# EAGLE design mosfet_breakout (EAGLE 5.10)
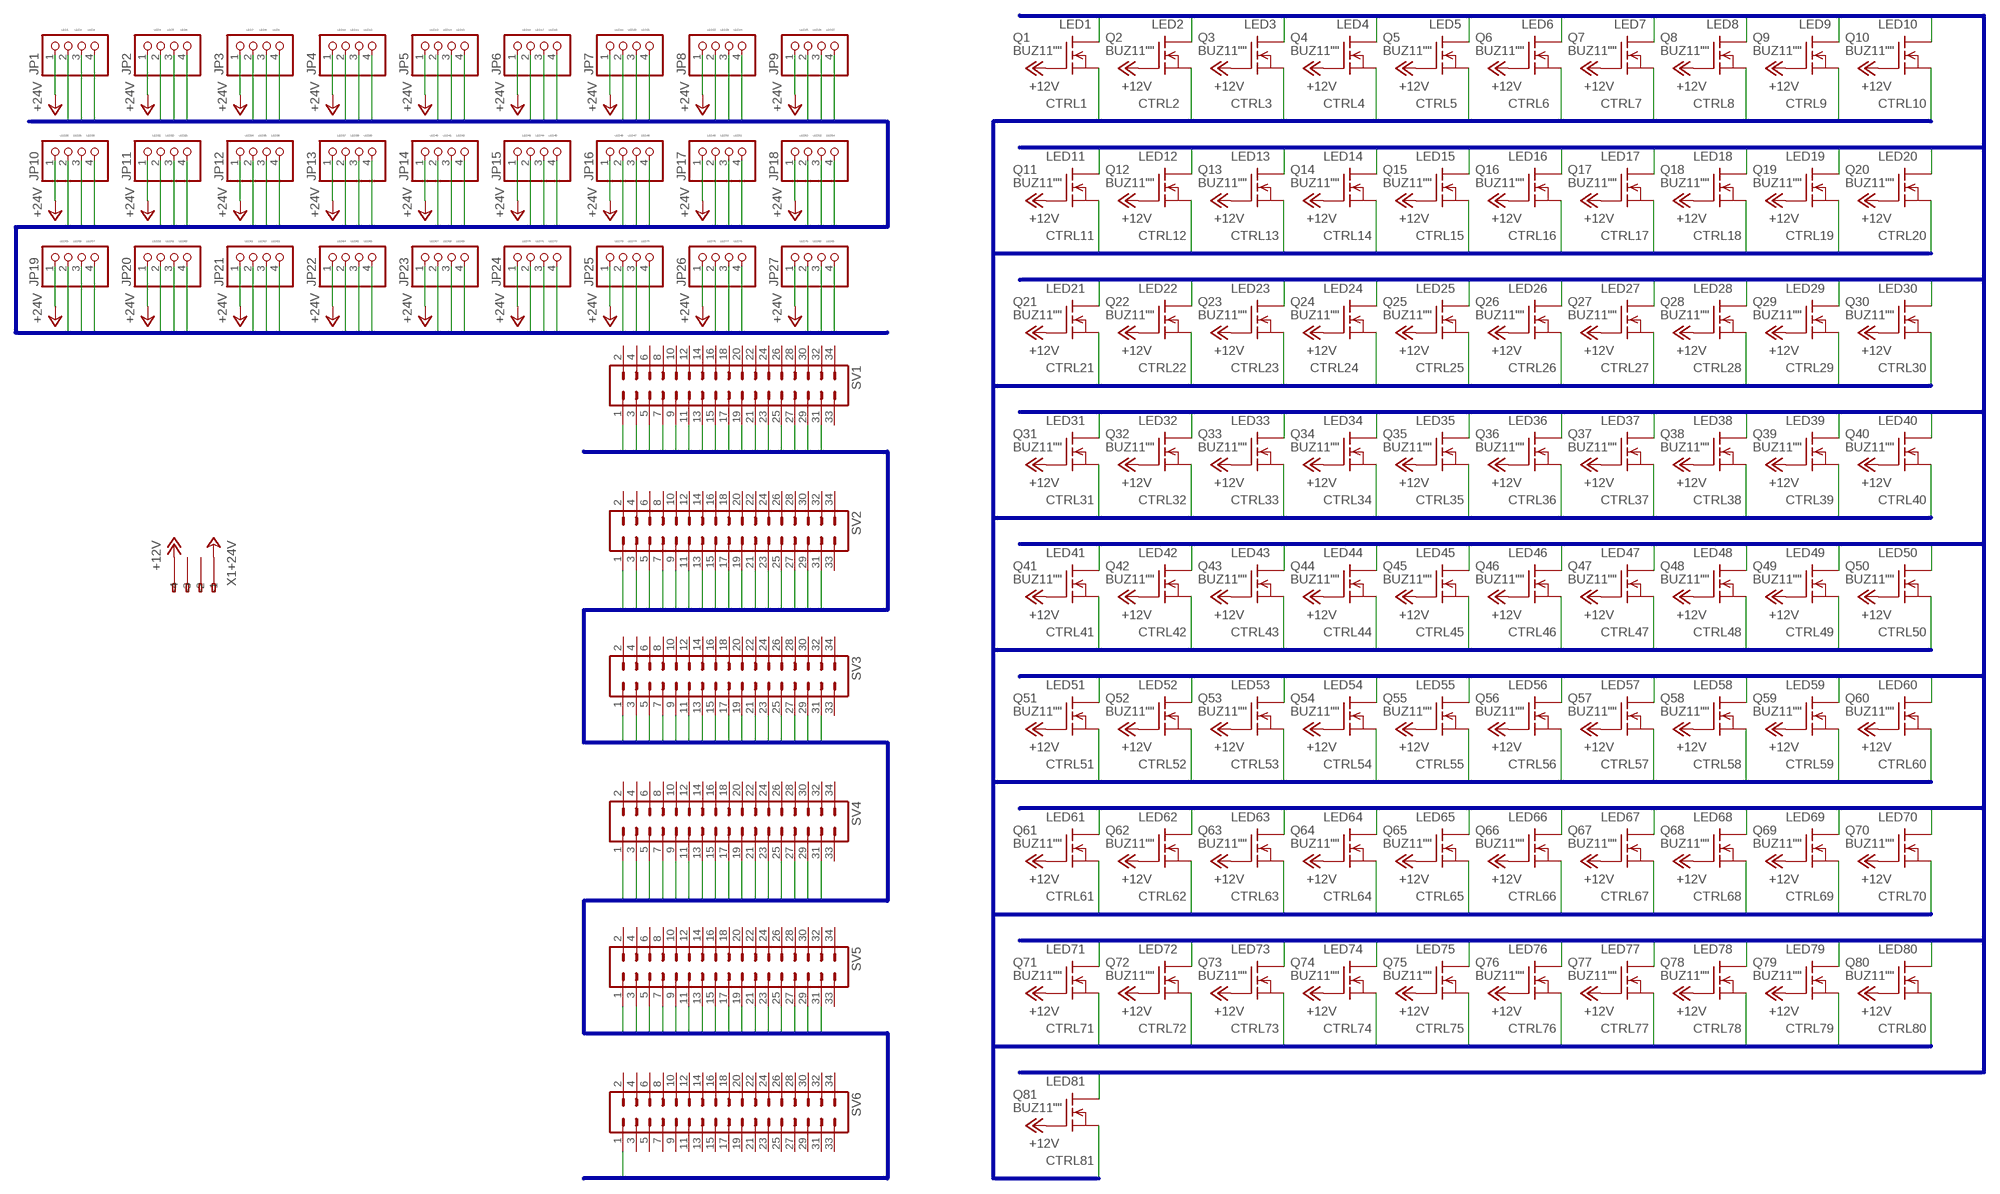
[diagram p0: schematic, sheet 1]

## Parts
JP1  PINHD-1X4  [1X04]
JP2  PINHD-1X4  [1X04]
JP3  PINHD-1X4  [1X04]
JP4  PINHD-1X4  [1X04]
JP5  PINHD-1X4  [1X04]
JP6  PINHD-1X4  [1X04]
JP7  PINHD-1X4  [1X04]
JP8  PINHD-1X4  [1X04]
JP9  PINHD-1X4  [1X04]
JP10  PINHD-1X4  [1X04]
JP11  PINHD-1X4  [1X04]
JP12  PINHD-1X4  [1X04]
JP13  PINHD-1X4  [1X04]
JP14  PINHD-1X4  [1X04]
JP15  PINHD-1X4  [1X04]
JP16  PINHD-1X4  [1X04]
JP17  PINHD-1X4  [1X04]
JP18  PINHD-1X4  [1X04]
JP19  PINHD-1X4  [1X04]
JP20  PINHD-1X4  [1X04]
JP21  PINHD-1X4  [1X04]
JP22  PINHD-1X4  [1X04]
JP23  PINHD-1X4  [1X04]
JP24  PINHD-1X4  [1X04]
JP25  PINHD-1X4  [1X04]
JP26  PINHD-1X4  [1X04]
JP27  PINHD-1X4  [1X04]
Q1  BUZ11""  [SOT23]
Q2  BUZ11""  [SOT23]
Q3  BUZ11""  [SOT23]
Q4  BUZ11""  [SOT23]
Q5  BUZ11""  [SOT23]
Q6  BUZ11""  [SOT23]
Q7  BUZ11""  [SOT23]
Q8  BUZ11""  [SOT23]
Q9  BUZ11""  [SOT23]
Q10  BUZ11""  [SOT23]
Q11  BUZ11""  [SOT23]
Q12  BUZ11""  [SOT23]
Q13  BUZ11""  [SOT23]
Q14  BUZ11""  [SOT23]
Q15  BUZ11""  [SOT23]
Q16  BUZ11""  [SOT23]
Q17  BUZ11""  [SOT23]
Q18  BUZ11""  [SOT23]
Q19  BUZ11""  [SOT23]
Q20  BUZ11""  [SOT23]
Q21  BUZ11""  [SOT23]
Q22  BUZ11""  [SOT23]
Q23  BUZ11""  [SOT23]
Q24  BUZ11""  [SOT23]
Q25  BUZ11""  [SOT23]
Q26  BUZ11""  [SOT23]
Q27  BUZ11""  [SOT23]
Q28  BUZ11""  [SOT23]
Q29  BUZ11""  [SOT23]
Q30  BUZ11""  [SOT23]
Q31  BUZ11""  [SOT23]
Q32  BUZ11""  [SOT23]
Q33  BUZ11""  [SOT23]
Q34  BUZ11""  [SOT23]
Q35  BUZ11""  [SOT23]
Q36  BUZ11""  [SOT23]
Q37  BUZ11""  [SOT23]
Q38  BUZ11""  [SOT23]
Q39  BUZ11""  [SOT23]
Q40  BUZ11""  [SOT23]
Q41  BUZ11""  [SOT23]
Q42  BUZ11""  [SOT23]
Q43  BUZ11""  [SOT23]
Q44  BUZ11""  [SOT23]
Q45  BUZ11""  [SOT23]
Q46  BUZ11""  [SOT23]
Q47  BUZ11""  [SOT23]
Q48  BUZ11""  [SOT23]
Q49  BUZ11""  [SOT23]
Q50  BUZ11""  [SOT23]
Q51  BUZ11""  [SOT23]
Q52  BUZ11""  [SOT23]
Q53  BUZ11""  [SOT23]
Q54  BUZ11""  [SOT23]
Q55  BUZ11""  [SOT23]
Q56  BUZ11""  [SOT23]
Q57  BUZ11""  [SOT23]
Q58  BUZ11""  [SOT23]
Q59  BUZ11""  [SOT23]
Q60  BUZ11""  [SOT23]
Q61  BUZ11""  [SOT23]
Q62  BUZ11""  [SOT23]
Q63  BUZ11""  [SOT23]
Q64  BUZ11""  [SOT23]
Q65  BUZ11""  [SOT23]
Q66  BUZ11""  [SOT23]
Q67  BUZ11""  [SOT23]
Q68  BUZ11""  [SOT23]
Q69  BUZ11""  [SOT23]
Q70  BUZ11""  [SOT23]
Q71  BUZ11""  [SOT23]
Q72  BUZ11""  [SOT23]
Q73  BUZ11""  [SOT23]
Q74  BUZ11""  [SOT23]
Q75  BUZ11""  [SOT23]
Q76  BUZ11""  [SOT23]
Q77  BUZ11""  [SOT23]
Q78  BUZ11""  [SOT23]
Q79  BUZ11""  [SOT23]
Q80  BUZ11""  [SOT23]
Q81  BUZ11""  [SOT23]
SV1  ML34  [ML34]
SV2  ML34  [ML34]
SV3  ML34  [ML34]
SV4  ML34  [ML34]
SV5  ML34  [ML34]
SV6  ML34  [ML34]
X1  233-104  [233-104]

## Nets
+12V: Q1.1(G) Q2.1(G) Q3.1(G) Q4.1(G) Q5.1(G) Q6.1(G) Q7.1(G) Q8.1(G) Q9.1(G) Q10.1(G) Q11.1(G) Q12.1(G) Q13.1(G) Q14.1(G) Q15.1(G) Q16.1(G) Q17.1(G) Q18.1(G) Q19.1(G) Q20.1(G) Q21.1(G) Q22.1(G) Q23.1(G) Q24.1(G) Q25.1(G) Q26.1(G) Q27.1(G) Q28.1(G) Q29.1(G) Q30.1(G) Q31.1(G) Q32.1(G) Q33.1(G) Q34.1(G) Q35.1(G) Q36.1(G) Q37.1(G) Q38.1(G) Q39.1(G) Q40.1(G) Q41.1(G) Q42.1(G) Q43.1(G) Q44.1(G) Q45.1(G) Q46.1(G) Q47.1(G) Q48.1(G) Q49.1(G) Q50.1(G) Q51.1(G) Q52.1(G) Q53.1(G) Q54.1(G) Q55.1(G) Q56.1(G) Q57.1(G) Q58.1(G) Q59.1(G) Q60.1(G) Q61.1(G) Q62.1(G) Q63.1(G) Q64.1(G) Q65.1(G) Q66.1(G) Q67.1(G) Q68.1(G) Q69.1(G) Q70.1(G) Q71.1(G) Q72.1(G) Q73.1(G) Q74.1(G) Q75.1(G) Q76.1(G) Q77.1(G) Q78.1(G) Q79.1(G) Q80.1(G) Q81.1(G) X1.A4(-4)
+24V: JP1.1 JP2.1 JP3.1 JP4.1 JP5.1 JP6.1 JP7.1 JP8.1 JP9.1 JP10.1 JP11.1 JP12.1 JP13.1 JP14.1 JP15.1 JP16.1 JP17.1 JP18.1 JP19.1 JP20.1 JP21.1 JP22.1 JP23.1 JP24.1 JP25.1 JP26.1 JP27.1 X1.A1(-1)
CTRL1: Q1.2(S) SV1.1
CTRL2: Q2.2(S) SV1.3
CTRL3: Q3.2(S) SV1.5
CTRL4: Q4.2(S) SV1.7
CTRL5: Q5.2(S) SV1.9
CTRL6: Q6.2(S) SV1.11
CTRL7: Q7.2(S) SV1.13
CTRL8: Q8.2(S) SV1.15
CTRL9: Q9.2(S) SV1.17
CTRL10: Q10.2(S) SV1.19
CTRL11: Q11.2(S) SV1.21
CTRL12: Q12.2(S) SV1.23
CTRL13: Q13.2(S) SV1.25
CTRL14: Q14.2(S) SV1.27
CTRL15: Q15.2(S) SV1.29
CTRL16: Q16.2(S) SV1.31
CTRL17: Q17.2(S) SV2.1
CTRL18: Q18.2(S) SV2.3
CTRL19: Q19.2(S) SV2.5
CTRL20: Q20.2(S)
CTRL21: Q21.2(S) SV2.9
CTRL22: Q22.2(S) SV2.7 SV2.11
CTRL23: Q23.2(S) SV2.13
CTRL24: Q24.2(S) SV2.15
CTRL25: Q25.2(S) SV2.17
CTRL26: Q26.2(S) SV2.19
CTRL27: Q27.2(S) SV2.21
CTRL28: Q28.2(S) SV2.23
CTRL29: Q29.2(S) SV2.25
CTRL30: Q30.2(S) SV2.27
CTRL31: Q31.2(S) SV2.29
CTRL32: Q32.2(S) SV2.31
CTRL33: Q33.2(S) SV3.1
CTRL34: Q34.2(S) SV3.3
CTRL35: Q35.2(S) SV3.5
CTRL36: Q36.2(S) SV3.7
CTRL37: Q37.2(S) SV3.9
CTRL38: Q38.2(S) SV3.11
CTRL39: Q39.2(S) SV3.13
CTRL40: Q40.2(S) SV3.15
CTRL41: Q41.2(S) SV3.17
CTRL42: Q42.2(S) SV3.19
CTRL43: Q43.2(S) SV3.21
CTRL44: Q44.2(S) SV3.23
CTRL45: Q45.2(S) SV3.25
CTRL46: Q46.2(S) SV3.27
CTRL47: Q47.2(S) SV3.29
CTRL48: Q48.2(S) SV3.31
CTRL49: Q49.2(S) SV4.1
CTRL50: Q50.2(S) SV4.3
CTRL51: Q51.2(S) SV4.5
CTRL52: Q52.2(S) SV4.7
CTRL53: Q53.2(S) SV4.9
CTRL54: Q54.2(S) SV4.11
CTRL55: Q55.2(S) SV4.13
CTRL56: Q56.2(S) SV4.15
CTRL57: Q57.2(S) SV4.17
CTRL58: Q58.2(S) SV4.19
CTRL59: Q59.2(S) SV4.21
CTRL60: Q60.2(S) SV4.23
CTRL61: Q61.2(S) SV4.25
CTRL62: Q62.2(S) SV4.27
CTRL63: Q63.2(S) SV4.29
CTRL64: Q64.2(S) SV4.31
CTRL65: Q65.2(S) SV5.1
CTRL66: Q66.2(S) SV5.3
CTRL67: Q67.2(S) SV5.5
CTRL68: Q68.2(S) SV5.7
CTRL69: Q69.2(S) SV5.9
CTRL70: Q70.2(S) SV5.11
CTRL71: Q71.2(S) SV5.13
CTRL72: Q72.2(S) SV5.15
CTRL73: Q73.2(S) SV5.17
CTRL74: Q74.2(S) SV5.19
CTRL75: Q75.2(S) SV5.21
CTRL76: Q76.2(S) SV5.23
CTRL77: Q77.2(S) SV5.25
CTRL78: Q78.2(S) SV5.27
CTRL79: Q79.2(S) SV5.29
CTRL80: Q80.2(S) SV5.31
CTRL81: Q81.2(S) SV6.1
LED1: JP1.2 Q1.3(D)
LED2: JP1.3 Q2.3(D)
LED3: JP1.4 Q3.3(D)
LED4: JP2.2 Q4.3(D)
LED5: JP2.3 Q5.3(D)
LED6: JP2.4 Q6.3(D)
LED7: JP3.2 Q7.3(D)
LED8: JP3.3 Q8.3(D)
LED9: JP3.4 Q9.3(D)
LED10: JP4.2 Q10.3(D)
LED11: JP4.3 Q11.3(D)
LED12: JP4.4 Q12.3(D)
LED13: JP5.2 Q13.3(D)
LED14: JP5.3 Q14.3(D)
LED15: JP5.4 Q15.3(D)
LED16: JP6.2 Q16.3(D)
LED17: JP6.3 Q17.3(D)
LED18: JP6.4 Q18.3(D)
LED19: JP7.2 Q19.3(D)
LED20: JP7.3 Q20.3(D)
LED21: JP7.4 Q21.3(D)
LED22: JP8.2 Q22.3(D)
LED23: JP8.3 Q23.3(D)
LED24: JP8.4 Q24.3(D)
LED25: JP9.2 Q25.3(D)
LED26: JP9.3 Q26.3(D)
LED27: JP9.4 Q27.3(D)
LED28: JP10.2 Q28.3(D)
LED29: JP10.3 Q29.3(D)
LED30: JP10.4 Q30.3(D)
LED31: JP11.2 Q31.3(D)
LED32: JP11.3 Q32.3(D)
LED33: JP11.4 Q33.3(D)
LED34: JP12.2 Q34.3(D)
LED35: JP12.3 Q35.3(D)
LED36: JP12.4 Q36.3(D)
LED37: JP13.2 Q37.3(D)
LED38: JP13.3 Q38.3(D)
LED39: JP13.4 Q39.3(D)
LED40: JP14.2 Q40.3(D)
LED41: JP14.3 Q41.3(D)
LED42: JP14.4 Q42.3(D)
LED43: JP15.2 Q43.3(D)
LED44: JP15.3 Q44.3(D)
LED45: JP15.4 Q45.3(D)
LED46: JP16.2 Q46.3(D)
LED47: JP16.3 Q47.3(D)
LED48: JP16.4 Q48.3(D)
LED49: JP17.2 Q49.3(D)
LED50: JP17.3 Q50.3(D)
LED51: JP17.4 Q51.3(D)
LED52: JP18.2 Q52.3(D)
LED53: JP18.3 Q53.3(D)
LED54: JP18.4 Q54.3(D)
LED55: JP19.2 Q55.3(D)
LED56: JP19.3 Q56.3(D)
LED57: JP19.4 Q57.3(D)
LED58: JP20.2 Q58.3(D)
LED59: JP20.3 Q59.3(D)
LED60: JP20.4 Q60.3(D)
LED61: JP21.2 Q61.3(D)
LED62: JP21.3 Q62.3(D)
LED63: JP21.4 Q63.3(D)
LED64: JP22.2 Q64.3(D)
LED65: JP22.3 Q65.3(D)
LED66: JP22.4 Q66.3(D)
LED67: JP23.2 Q67.3(D)
LED68: JP23.3 Q68.3(D)
LED69: JP23.4 Q69.3(D)
LED70: JP24.2 Q70.3(D)
LED71: JP24.3 Q71.3(D)
LED72: JP24.4 Q72.3(D)
LED73: JP25.2 Q73.3(D)
LED74: JP25.3 Q74.3(D)
LED75: JP25.4 Q75.3(D)
LED76: JP26.2 Q76.3(D)
LED77: JP26.3 Q77.3(D)
LED78: JP26.4 Q78.3(D)
LED79: JP27.2 Q79.3(D)
LED80: JP27.3 Q80.3(D)
LED81: JP27.4 Q81.3(D)
Unconnected: SV1.2 SV1.4 SV1.6 SV1.8 SV1.10 SV1.12 SV1.14 SV1.16 SV1.18 SV1.20 SV1.22 SV1.24 SV1.26 SV1.28 SV1.30 SV1.32 SV1.33 SV1.34 SV2.2 SV2.4 SV2.6 SV2.8 SV2.10 SV2.12 SV2.14 SV2.16 SV2.18 SV2.20 SV2.22 SV2.24 SV2.26 SV2.28 SV2.30 SV2.32 SV2.33 SV2.34 SV3.2 SV3.4 SV3.6 SV3.8 SV3.10 SV3.12 SV3.14 SV3.16 SV3.18 SV3.20 SV3.22 SV3.24 SV3.26 SV3.28 SV3.30 SV3.32 SV3.33 SV3.34 SV4.2 SV4.4 SV4.6 SV4.8 SV4.10 SV4.12 SV4.14 SV4.16 SV4.18 SV4.20 SV4.22 SV4.24 SV4.26 SV4.28 SV4.30 SV4.32 SV4.33 SV4.34 SV5.2 SV5.4 SV5.6 SV5.8 SV5.10 SV5.12 SV5.14 SV5.16 SV5.18 SV5.20 SV5.22 SV5.24 SV5.26 SV5.28 SV5.30 SV5.32 SV5.33 SV5.34 SV6.2 SV6.3 SV6.4 SV6.5 SV6.6 SV6.7 SV6.8 SV6.9 SV6.10 SV6.11 SV6.12 SV6.13 SV6.14 SV6.15 SV6.16 SV6.17 SV6.18 SV6.19 SV6.20 SV6.21 SV6.22 SV6.23 SV6.24 SV6.25 SV6.26 SV6.27 SV6.28 SV6.29 SV6.30 SV6.31 SV6.32 SV6.33 SV6.34 X1.A2(-2) X1.A3(-3) X1.B1(B-1) X1.B2(B-2) X1.B3(B-3) X1.B4(B-4)

## Buses
LED[1..81]
CTRL[1..81]

## Library data of the parts
JP1-JP27 = aug_parts:PINHD-1X4: PIN HEADER
Q1-Q81 = aug_parts:BUZ11: N-Channel Enhancement MOSFET 50V; 30A; 0,040Ohm
SV1-SV6 = con-harting-ml:ML34: HARTING
X1 = con-wago:233-104: WAGO Cage Clamp

## Board
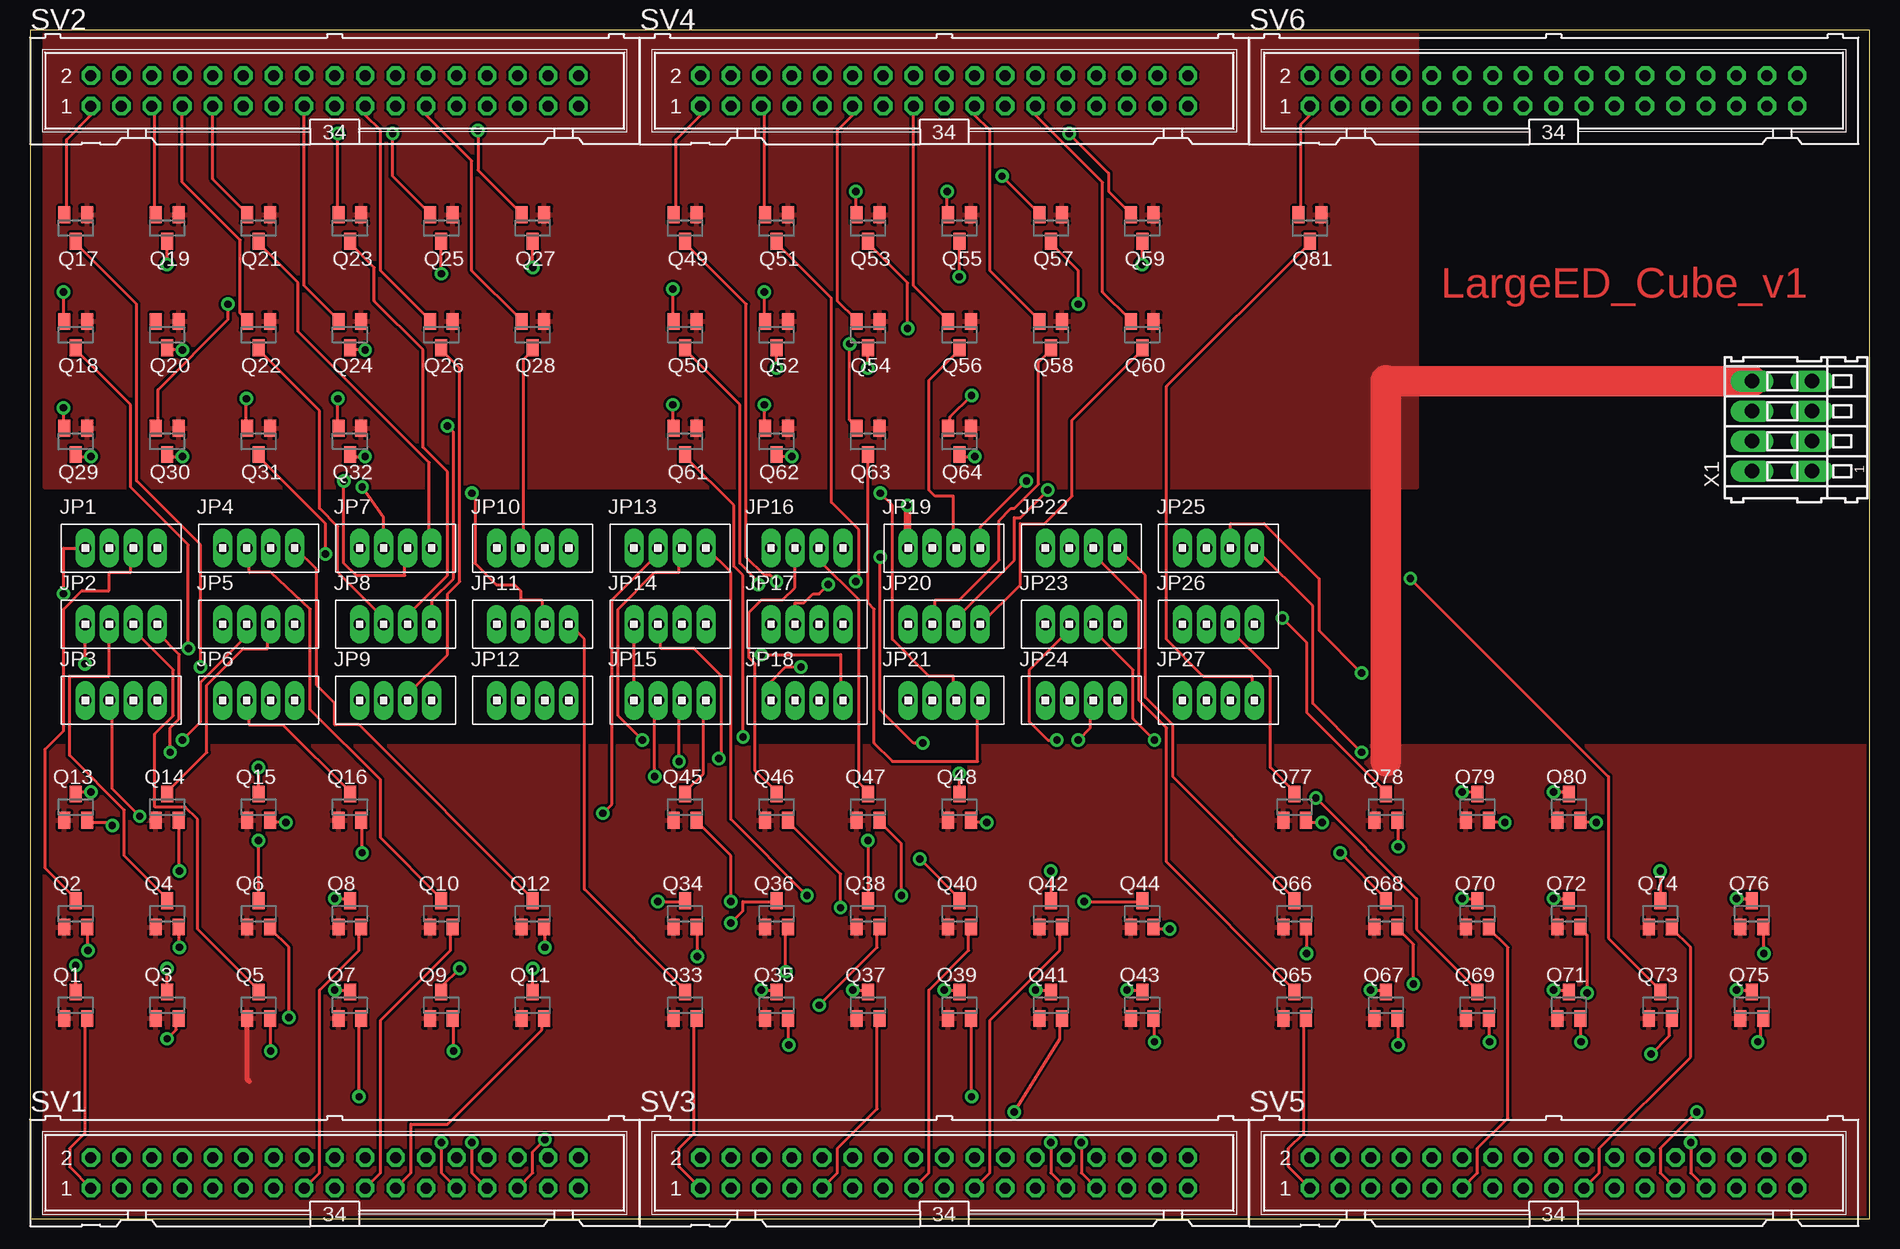
[diagram p1: board, top side]
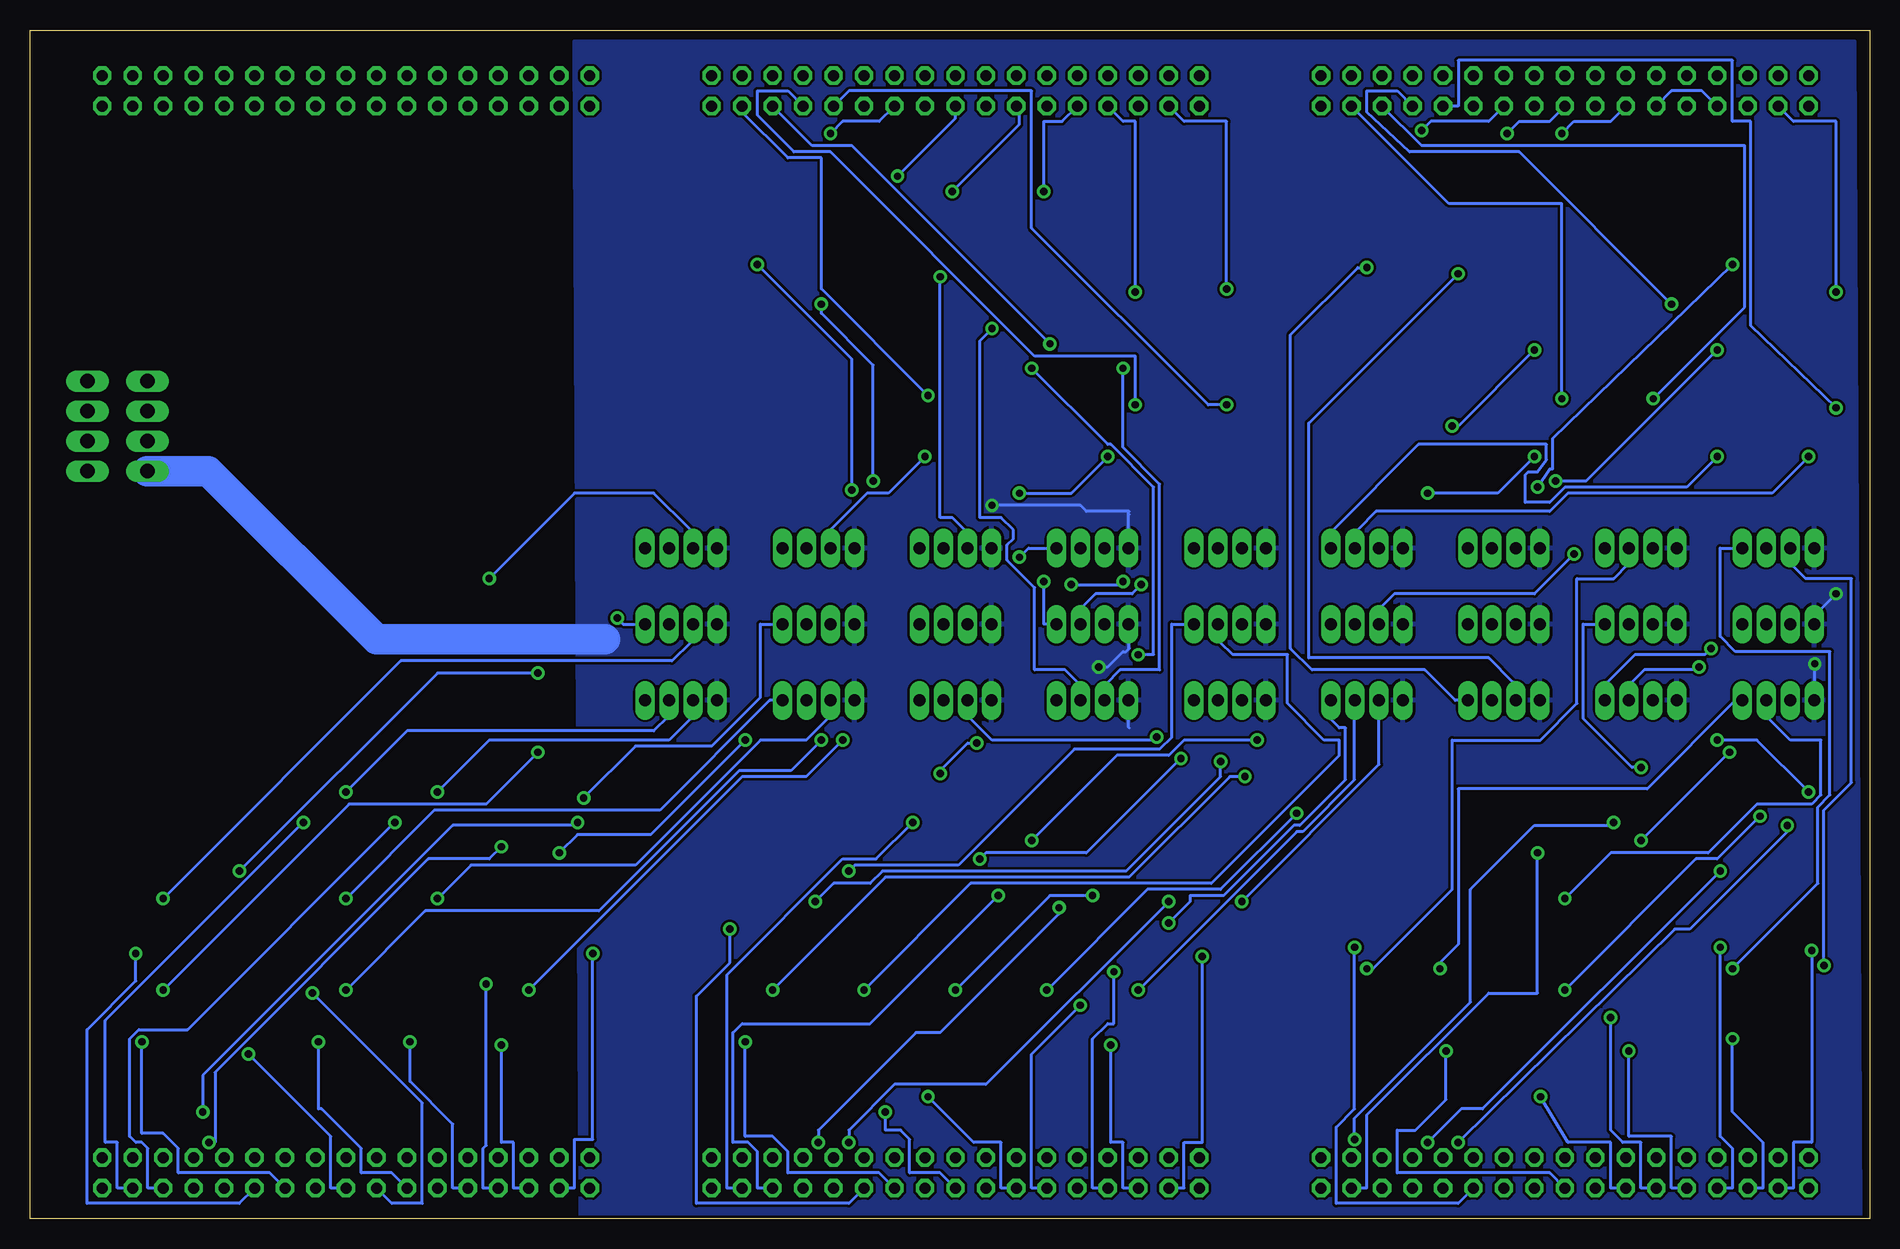
[diagram p2: board, bottom side, seen from below]

Size 153.34 x 99.05 mm. Coordinates in mm from the lower left corner, seen from the top.
Outline: 0,0 153.34,0 153.34,99.05 0,99.05 0,0
Copper layers (1*16): Top 0.035mm / dielectric 1.5mm / Bottom 0.035mm
Design rules "SparkFun": minimum track width 8mil, minimum drill 20mil, track to track 8mil, track to pad 8mil, pad to pad 8mil, via to via 8mil, smd to smd 8mil, copper to edge 10mil, drill to drill 8mil, minimum pad ring 12mil, minimum via ring 10mil, stop-mask expansion 4mil, vias tented up to drill 25mil, thermal gap 10mil

### Footprints (pad centres in the part's own frame; a part is rotated, then mirrored left to right if it is on the bottom)
1X04 = drill 1 long: 1 -3,0; 2 -1,0; 3 1,0; 4 3,0
SOT23 = smd 1 x 1.4: 1 -0.95,-1.1; 2 0.95,-1.1; 3 0,1.1
ML34 = drill 0.914 octagon: 1 -20.32,-1.27; 2 -20.32,1.27; 3 -17.78,-1.27; 4 -17.78,1.27; 5 -15.24,-1.27; 6 -15.24,1.27; 7 -12.7,-1.27; 8 -12.7,1.27; 9 -10.16,-1.27; 10 -10.16,1.27; 11 -7.62,-1.27; 12 -7.62,1.27; 13 -5.08,-1.27; 14 -5.08,1.27; 15 -2.54,-1.27; 16 -2.54,1.27; 17 0,-1.27; 18 0,1.27; 19 2.54,-1.27; 20 2.54,1.27; 21 5.08,-1.27; 22 5.08,1.27; 23 7.62,-1.27; 24 7.62,1.27; 25 10.16,-1.27; 26 10.16,1.27; 27 12.7,-1.27; 28 12.7,1.27; 29 15.24,-1.27; 30 15.24,1.27; 31 17.78,-1.27; 32 17.78,1.27; 33 20.32,-1.27; 34 20.32,1.27
233-104 = drill 1.2 long: A1 -3.75,2.5; A2 -1.25,2.5; A3 1.25,2.5; A4 3.75,2.5; B1 -3.75,-2.5; B2 -1.25,-2.5; B3 1.25,-2.5; B4 3.75,-2.5

### Placement (x,y rotation side)
JP1  7.62,55.88 0 top
JP2  7.62,49.53 0 top
JP3  7.62,43.18 0 top
JP4  19.05,55.88 0 top
JP5  19.05,49.53 0 top
JP6  19.05,43.18 0 top
JP7  30.48,55.88 0 top
JP8  30.48,49.53 0 top
JP9  30.48,43.18 0 top
JP10  41.91,55.88 0 top
JP11  41.91,49.53 0 top
JP12  41.91,43.18 0 top
JP13  53.34,55.88 0 top
JP14  53.34,49.53 0 top
JP15  53.34,43.18 0 top
JP16  64.77,55.88 0 top
JP17  64.77,49.53 0 top
JP18  64.77,43.18 0 top
JP19  76.2,55.88 0 top
JP20  76.2,49.53 0 top
JP21  76.2,43.18 0 top
JP22  87.63,55.88 0 top
JP23  87.63,49.53 0 top
JP24  87.63,43.18 0 top
JP25  99.06,55.88 0 top
JP26  99.06,49.53 0 top
JP27  99.06,43.18 0 top
Q1  3.81,17.78 0 top
Q2  3.81,25.4 0 top
Q3  11.43,17.78 0 top
Q4  11.43,25.4 0 top
Q5  19.05,17.78 0 top
Q6  19.05,25.4 0 top
Q7  26.67,17.78 0 top
Q8  26.67,25.4 0 top
Q9  34.29,17.78 0 top
Q10  34.29,25.4 0 top
Q11  41.91,17.78 0 top
Q12  41.91,25.4 0 top
Q13  3.81,34.29 0 top
Q14  11.43,34.29 0 top
Q15  19.05,34.29 0 top
Q16  26.67,34.29 0 top
Q17  3.81,82.55 180 top
Q18  3.81,73.66 180 top
Q19  11.43,82.55 180 top
Q20  11.43,73.66 180 top
Q21  19.05,82.55 180 top
Q22  19.05,73.66 180 top
Q23  26.67,82.55 180 top
Q24  26.67,73.66 180 top
Q25  34.29,82.55 180 top
Q26  34.29,73.66 180 top
Q27  41.91,82.55 180 top
Q28  41.91,73.66 180 top
Q29  3.81,64.77 180 top
Q30  11.43,64.77 180 top
Q31  19.05,64.77 180 top
Q32  26.67,64.77 180 top
Q33  54.61,17.78 0 top
Q34  54.61,25.4 0 top
Q35  62.23,17.78 0 top
Q36  62.23,25.4 0 top
Q37  69.85,17.78 0 top
Q38  69.85,25.4 0 top
Q39  77.47,17.78 0 top
Q40  77.47,25.4 0 top
Q41  85.09,17.78 0 top
Q42  85.09,25.4 0 top
Q43  92.71,17.78 0 top
Q44  92.71,25.4 0 top
Q45  54.61,34.29 0 top
Q46  62.23,34.29 0 top
Q47  69.85,34.29 0 top
Q48  77.47,34.29 0 top
Q49  54.61,82.55 180 top
Q50  54.61,73.66 180 top
Q51  62.23,82.55 180 top
Q52  62.23,73.66 180 top
Q53  69.85,82.55 180 top
Q54  69.85,73.66 180 top
Q55  77.47,82.55 180 top
Q56  77.47,73.66 180 top
Q57  85.09,82.55 180 top
Q58  85.09,73.66 180 top
Q59  92.71,82.55 180 top
Q60  92.71,73.66 180 top
Q61  54.61,64.77 180 top
Q62  62.23,64.77 180 top
Q63  69.85,64.77 180 top
Q64  77.47,64.77 180 top
Q65  105.41,17.78 0 top
Q66  105.41,25.4 0 top
Q67  113.03,17.78 0 top
Q68  113.03,25.4 0 top
Q69  120.65,17.78 0 top
Q70  120.65,25.4 0 top
Q71  128.27,17.78 0 top
Q72  128.27,25.4 0 top
Q73  135.89,17.78 0 top
Q74  135.89,25.4 0 top
Q75  143.51,17.78 0 top
Q76  143.51,25.4 0 top
Q77  105.41,34.29 0 top
Q78  113.03,34.29 0 top
Q79  120.65,34.29 0 top
Q80  128.27,34.29 0 top
Q81  106.68,82.55 180 top
SV1  25.4,3.81 0 top
SV2  25.4,93.98 0 top
SV3  76.2,3.81 0 top
SV4  76.2,93.98 0 top
SV5  127,3.81 0 top
SV6  127,93.98 0 top
X1  146.05,66.04 90 top

### Tracks (layer width: path | path; a pad name or v marks a point on that pad's centre or on a via)
+12V
  Top 0.406: Q5.1 18.1,11.62 18.29,11.43
  Top 2.54: X1.A4 113.09,69.79 113.03,69.85 113.03,38.1
  pour Top: 1.27,99.06 115.57,99.06 115.57,60.96 1.27,60.96
  pour Top: 1.27,39.37 153.67,39.37 153.67,0 1.27,0
+24V  (via drill 0.6)
  Top 0.254: JP18.1 61.77,44.75 62.99,45.97 v64.26,45.97 | JP15.1 JP14.1 | v2.79,52.07 2.79,55.88 JP1.1 | JP2.1 4.62,46.28 v4.57,46.23
  Top 0.61: v73.15,59.44 73.15,55.93 JP19.1
  Bottom 0.254: 61.72,58.67 61.77,58.63 JP16.1 61.77,58.88 61.72,58.93 65.28,58.93 65.79,59.44 v73.15,59.44 | JP18.1 61.77,40.94 61.72,40.89 | v64.26,45.97 63.5,45.97 62.23,47.24 61.98,47.24 61.72,47.5 61.72,49.48 JP17.1 | JP2.1 4.62,50.24 v2.79,52.07 | v4.57,46.23 4.57,43.23 JP3.1
  Bottom 2.54: X1.A1 138.49,62.29 124.46,48.26 105.41,48.26
  pour Bottom: 1.27,98.04 107.95,98.04 107.44,0 0.76,0
CTRL1
  Top 0.254: SV1.1 3.3,4.32 3.3,5.84 4.57,7.11 4.57,16.51 Q1.2
CTRL2  (via drill 0.61)
  Top 0.254: v4.83,22.35 4.83,24.13 Q2.2
  Bottom 0.254: v4.83,22.35 4.83,6.35 6.35,6.35 6.35,2.54 SV1.3
CTRL3  (via drill 0.61)
  Top 0.254: v11.43,14.99 12.19,15.75 12.19,16.51 Q3.2
  Bottom 0.254: v11.43,14.99 11.43,8.89 8.89,6.35 8.89,2.54 SV1.5
CTRL4  (via drill 0.61)
  Top 0.254: v12.45,22.61 12.45,24.13 Q4.2
  Bottom 0.254: v12.45,22.61 12.45,6.86 11.43,5.84 11.43,2.54 SV1.7
CTRL5  (via drill 0.61)
  Top 0.254: v20.07,13.97 20.07,16.51 Q5.2
  Bottom 0.254: v20.07,13.97 20.07,6.86 16.51,6.86 16.51,2.54 SV1.9
CTRL6  (via drill 0.61)
  Top 0.254: v21.59,16.76 21.59,22.61 20.07,24.13 Q6.2
  Bottom 0.254: v21.59,16.76 21.59,7.37 20.57,6.35 19.05,6.35 19.05,2.54 SV1.11
CTRL7  (via drill 0.61)
  Top 0.254: v27.43,10.16 27.43,16.51 Q7.2
  Bottom 0.254: v27.43,10.16 25.15,6.35 21.59,6.35 21.59,2.54 SV1.13
CTRL8
  Top 0.254: SV1.15 24.13,3.81 24.13,19.05 27.43,22.35 27.43,24.13 Q8.2
CTRL9  (via drill 0.61)
  Top 0.254: v35.31,13.97 35.31,16.51 Q9.2
  Bottom 0.254: SV1.17 26.67,3.81 39.37,3.81 39.37,7.37 37.85,7.37 35.31,9.91 v35.31,13.97
CTRL10
  Top 0.254: SV1.19 29.21,3.81 29.21,16.51 35.05,22.35 35.05,24.13 Q10.2
CTRL11
  Top 0.254: SV1.21 31.75,3.81 31.75,7.87 34.8,7.87 42.67,15.75 42.67,16.51 Q11.2
CTRL12  (via drill 0.61)
  Top 0.254: v42.93,22.61 42.93,24.13 Q12.2
  Bottom 0.254: v42.93,22.61 42.93,9.14 44.45,7.62 44.45,1.27 34.29,1.27 SV1.23
CTRL13  (via drill 0.61)
  Top 0.254: v6.86,32.77 6.86,33.02 4.83,33.02 Q13.2 | v34.29,6.35 34.29,3.81 SV1.25
  Bottom 0.254: v6.86,32.77 6.86,32.26 14.99,24.13 16.26,24.13 v34.29,6.35
CTRL14  (via drill 0.61)
  Top 0.254: v12.45,28.96 12.45,33.02 Q14.2 | v36.83,6.35 36.83,3.81 SV1.27
  Bottom 0.254: v12.45,28.96 32.26,9.14 34.04,9.14 v36.83,6.35
CTRL15  (via drill 0.61)
  Top 0.254: v21.34,33.02 20.07,33.02 Q15.2 | v42.93,6.6 41.91,5.59 41.91,3.81 SV1.29
  Bottom 0.254: v21.34,33.02 21.59,32.77 27.94,32.77 33.27,27.43 33.27,18.03 42.93,8.38 v42.93,6.6
CTRL16  (via drill 0.61)
  Top 0.254: v27.69,30.48 27.69,33.02 Q16.2
  Bottom 0.254: v27.69,30.48 27.69,18.8 31.75,18.8 41.91,8.64 41.91,2.54 SV1.31
CTRL17
  Top 0.254: SV2.1 5.08,91.95 3.05,89.92 3.05,83.82 Q17.2
CTRL18  (via drill 0.61)
  Top 0.254: v2.79,77.22 2.79,74.93 Q18.2
  Bottom 0.254: v2.79,77.22 2.79,91.44 6.35,91.44 SV2.3
CTRL19
  Top 0.254: SV2.5 10.41,92.46 10.41,83.82 Q19.2
CTRL21
  Top 0.254: SV2.9 15.24,86.61 18.03,83.82 Q21.2
CTRL22
  Top 0.254: SV2.7 12.7,86.36 17.53,81.53 17.53,75.44 18.03,74.93 Q22.2
  Bottom 0.254: SV2.11 16.51,93.98 13.97,93.98 SV2.7
CTRL23  (via drill 0.61)
  Top 0.254: v25.65,90.42 25.65,83.82 Q23.2
  Bottom 0.254: v25.65,90.42 24.64,91.44 21.59,91.44 SV2.13
CTRL24
  Top 0.254: SV2.15 22.86,77.72 25.65,74.93 Q24.2
CTRL25  (via drill 0.61)
  Top 0.254: v30.23,90.42 30.23,86.87 33.27,83.82 Q25.2
  Bottom 0.254: v30.23,90.42 29.21,91.44 26.67,91.44 SV2.17
CTRL26
  Top 0.254: SV2.19 27.94,91.95 29.21,90.68 29.21,78.99 33.27,74.93 Q26.2
CTRL27  (via drill 0.61)
  Top 0.254: v37.34,90.68 37.34,87.38 40.89,83.82 Q27.2
  Bottom 0.254: v37.34,90.68 36.58,91.44 31.75,91.44 SV2.21
CTRL28
  Top 0.254: SV2.23 33.02,91.95 36.83,88.14 36.83,78.99 40.89,74.93 Q28.2
CTRL29  (via drill 0.61)
  Top 0.254: v2.79,67.56 2.79,66.04 Q29.2
  Bottom 0.254: v2.79,67.56 9.91,74.42 9.91,91.44 11.43,91.44 11.43,96.52 34.29,96.52 34.29,92.71 SV2.25
CTRL30  (via drill 0.61)
  Top 0.254: v16.51,76.2 16.51,74.93 10.67,69.09 10.67,66.04 Q30.2
  Bottom 0.254: v16.51,76.2 29.21,88.9 38.35,88.9 41.91,92.2 41.91,93.98 39.37,93.98 SV2.27
CTRL31  (via drill 0.61)
  Top 0.254: v18.03,68.33 18.03,66.04 Q31.2
  Bottom 0.254: v18.03,68.33 10.41,75.95 10.41,89.41 37.34,89.41 SV2.29
CTRL32  (via drill 0.61)
  Top 0.254: v25.65,68.33 25.65,66.04 Q32.2
  Bottom 0.254: v25.65,68.33 25.65,84.58 35.05,84.58 SV2.31
CTRL33
  Top 0.254: SV3.1 54.1,4.32 54.1,5.84 55.37,7.11 55.37,16.51 Q33.2
CTRL34  (via drill 0.61)
  Top 0.254: v55.63,21.84 55.63,24.13 Q34.2
  Bottom 0.254: v55.63,21.84 55.63,6.35 57.15,6.35 57.15,2.54 SV3.3
CTRL35  (via drill 0.61)
  Top 0.254: v63.25,14.48 63.25,16.51 Q35.2
  Bottom 0.254: v63.25,14.48 63.25,6.35 62.23,6.35 62.23,2.54 SV3.5
CTRL36  (via drill 0.61)
  Top 0.254: v62.99,20.57 62.99,24.13 Q36.2
  Bottom 0.254: v62.99,20.57 62.99,16.26 63.5,16.26 64.77,14.99 64.77,2.54 SV3.7
CTRL37
  Top 0.254: SV3.9 67.31,3.81 67.31,5.84 70.61,9.14 70.61,16.51 Q37.2
CTRL38  (via drill 0.61)
  Top 0.254: v65.79,17.78 70.61,22.61 70.61,24.13 Q38.2
  Bottom 0.254: v65.79,17.78 69.85,13.72 69.85,2.54 SV3.11
CTRL39  (via drill 0.61)
  Top 0.254: v78.49,10.16 78.49,16.51 Q39.2
  Bottom 0.254: v78.49,10.16 74.68,6.35 72.39,6.35 72.39,2.54 SV3.13
CTRL40
  Top 0.254: SV3.15 74.93,3.81 74.93,19.05 78.23,22.35 78.23,24.13 Q40.2
CTRL41  (via drill 0.61)
  Top 0.254: v82.04,8.89 85.85,14.99 85.85,16.51 Q41.2
  Bottom 0.254: SV3.17 77.47,3.81 80.01,3.81 80.01,6.6 80.77,7.37 82.04,7.37 v82.04,8.89
CTRL42
  Top 0.254: SV3.19 80.01,3.81 80.01,16.51 85.85,22.35 85.85,24.13 Q42.2
CTRL43  (via drill 0.61)
  Top 0.254: v93.73,14.73 93.73,16.51 Q43.2
  Bottom 0.254: v93.73,14.73 93.73,6.86 91.44,6.86 90.17,5.59 90.17,3.81 82.55,3.81 SV3.21
CTRL44  (via drill 0.61)
  Top 0.254: v95,24.13 93.73,24.13 Q44.2
  Bottom 0.254: v95,24.13 95,21.34 97.79,18.54 97.79,1.27 85.09,1.27 SV3.23
CTRL45  (via drill 0.61)
  Top 0.254: v58.42,26.42 58.42,30.23 55.63,33.02 Q45.2 | v85.09,6.35 85.09,3.81 SV3.25
  Bottom 0.254: v58.42,26.42 73.66,11.18 81.28,11.18 85.09,7.37 v85.09,6.35
CTRL46  (via drill 0.61)
  Top 0.254: v67.56,25.91 67.56,28.7 63.25,33.02 Q46.2 | v87.63,6.35 87.63,3.81 SV3.27
  Bottom 0.254: v67.56,25.91 67.56,25.4 77.47,15.49 79.5,15.49 87.63,7.37 v87.63,6.35
CTRL47  (via drill 0.61)
  Top 0.254: v72.64,26.92 72.64,31.24 70.87,33.02 Q47.2
  Bottom 0.254: v72.64,26.92 83.31,16.26 93.98,16.26 94.74,15.49 94.74,6.35 93.47,6.35 92.71,5.59 92.71,2.54 SV3.29
CTRL48  (via drill 0.61)
  Top 0.254: v79.76,33.02 78.49,33.02 Q48.2
  Bottom 0.254: v79.76,33.02 82.8,29.97 85.6,29.97 95.25,20.32 95.25,2.54 SV3.31
CTRL49
  Top 0.254: SV4.1 55.88,91.95 53.85,89.92 53.85,83.82 Q49.2
CTRL50  (via drill 0.61)
  Top 0.254: v53.59,77.47 53.59,74.93 Q50.2
  Bottom 0.254: v53.59,77.47 53.59,91.44 57.15,91.44 SV4.3
CTRL51
  Top 0.254: SV4.5 61.21,92.46 61.21,83.82 Q51.2
CTRL52  (via drill 0.61)
  Top 0.254: v61.21,77.22 61.21,74.93 Q52.2
  Bottom 0.254: v61.21,77.22 61.21,91.44 62.23,91.44 SV4.7
CTRL53  (via drill 0.61)
  Top 0.254: v68.83,85.6 68.83,83.82 Q53.2
  Bottom 0.254: v68.83,85.6 68.83,91.44 67.31,91.44 SV4.9
CTRL54
  Top 0.254: SV4.11 68.58,91.95 67.31,90.68 67.31,76.45 68.83,74.93 Q54.2
CTRL55  (via drill 0.61)
  Top 0.254: v76.45,85.6 76.45,83.82 Q55.2
  Bottom 0.254: v76.45,85.6 70.87,91.19 70.87,92.71 SV4.13
CTRL56
  Top 0.254: SV4.15 73.66,77.72 76.45,74.93 Q56.2
CTRL57  (via drill 0.61)
  Top 0.254: v81.03,86.87 84.07,83.82 Q57.2
  Bottom 0.254: v81.03,86.87 76.2,91.69 SV4.17
CTRL58
  Top 0.254: SV4.19 78.74,91.95 80.01,90.68 80.01,78.99 84.07,74.93 Q58.2
CTRL59  (via drill 0.61)
  Top 0.254: v86.61,90.42 89.92,87.12 89.92,85.6 91.69,83.82 Q59.2
  Bottom 0.254: v86.61,90.42 85.6,91.44 82.55,91.44 SV4.21
CTRL60
  Top 0.254: SV4.23 83.82,91.95 89.41,86.36 89.41,77.22 91.69,74.93 Q60.2
CTRL61  (via drill 0.61)
  Top 0.254: v53.59,67.82 53.59,66.04 Q61.2
  Bottom 0.254: SV4.25 85.09,93.98 69.85,93.98 69.85,82.55 55.12,67.82 v53.59,67.82
CTRL62  (via drill 0.61)
  Top 0.254: v61.21,67.82 61.21,66.04 Q62.2
  Bottom 0.254: v61.21,67.82 61.21,71.88 69.6,71.88 86.61,88.9 89.66,88.9 92.71,91.95 92.71,93.98 90.17,93.98 SV4.27
CTRL63  (via drill 0.61)
  Top 0.254: v68.33,72.9 68.33,66.55 68.83,66.04 Q63.2
  Bottom 0.254: v68.33,72.9 84.84,89.41 88.14,89.41 SV4.29
CTRL64  (via drill 0.61)
  Top 0.254: v78.49,68.58 76.71,66.8 76.71,66.04 Q64.2
  Bottom 0.254: v78.49,68.58 87.38,77.47 87.38,88.39 90.17,88.39 93.98,92.2 SV4.31
CTRL65
  Top 0.254: SV5.1 104.9,4.32 104.9,5.84 106.17,7.11 106.17,16.51 Q65.2
CTRL66  (via drill 0.61)
  Top 0.254: v106.43,22.1 106.43,24.13 Q66.2
  Bottom 0.254: v106.43,22.1 106.43,6.6 107.95,6.6 107.95,2.54 SV5.3
CTRL67  (via drill 0.61)
  Top 0.254: v114.05,14.48 114.05,16.51 Q67.2
  Bottom 0.254: v114.05,14.48 114.05,6.35 113.03,6.35 113.03,2.54 SV5.5
CTRL68  (via drill 0.61)
  Top 0.254: v115.32,19.56 115.32,22.86 114.05,24.13 Q68.2
  Bottom 0.254: v115.32,19.56 115.32,6.1 115.57,5.84 115.57,2.54 SV5.7
CTRL69  (via drill 0.61)
  Top 0.254: v121.67,14.73 121.67,16.51 Q69.2
  Bottom 0.254: v121.67,14.73 121.67,11.43 118.11,7.87 118.11,2.54 SV5.9
CTRL70
  Top 0.254: SV5.11 120.65,3.81 120.65,5.84 123.19,8.38 123.19,22.61 121.67,24.13 Q70.2
CTRL71  (via drill 0.61)
  Top 0.254: v129.29,14.73 129.29,16.51 Q71.2
  Bottom 0.254: v129.29,14.73 129.29,9.14 129.03,9.14 125.73,5.84 125.73,3.81 123.19,3.81 SV5.13
CTRL72  (via drill 0.61)
  Top 0.254: v129.79,18.8 129.79,23.62 129.29,24.13 Q72.2
  Bottom 0.254: v129.79,18.8 120.65,9.65 120.65,1.27 123.19,1.27 SV5.15
CTRL73  (via drill 0.61)
  Top 0.254: v135.13,13.72 136.65,15.24 136.65,16.51 Q73.2
  Bottom 0.254: v135.13,13.72 128.27,6.86 128.27,2.54 SV5.17
CTRL74
  Top 0.254: SV5.19 130.81,3.81 130.81,5.84 138.43,13.46 138.43,22.61 136.91,24.13 Q74.2
CTRL75  (via drill 0.61)
  Top 0.254: v144.02,14.73 144.27,14.99 144.27,16.51 Q75.2
  Bottom 0.254: v144.02,14.73 144.02,7.11 142.24,7.11 140.97,5.84 140.97,3.81 133.35,3.81 SV5.21
CTRL76  (via drill 0.61)
  Top 0.254: v144.53,22.1 144.53,24.13 Q76.2
  Bottom 0.254: v144.53,22.1 144.53,19.81 148.59,15.75 148.59,1.27 135.89,1.27 SV5.23
CTRL77  (via drill 0.61)
  Top 0.254: v107.7,33.02 106.43,33.02 Q77.2 | v138.94,8.89 135.89,5.84 135.89,3.81 SV5.25
  Bottom 0.254: v107.7,33.02 107.95,32.77 118.11,32.77 138.94,11.94 v138.94,8.89
CTRL78  (via drill 0.61)
  Top 0.254: v114.05,30.99 114.05,33.02 Q78.2 | v138.43,6.35 138.43,3.81 SV5.27
  Bottom 0.254: v138.43,6.35 137.92,6.35 137.92,12.19 120.14,29.97 115.06,29.97 v114.05,30.99
CTRL79  (via drill 0.61)
  Top 0.254: v122.94,33.02 121.67,33.02 Q79.2
  Bottom 0.254: v122.94,33.02 140.21,15.75 144.27,15.75 145.03,14.99 145.03,6.86 144.53,6.35 144.02,6.35 143.51,5.84 143.51,2.54 SV5.29
CTRL80  (via drill 0.61)
  Top 0.254: v130.56,33.02 129.29,33.02 Q80.2
  Bottom 0.254: v130.56,33.02 147.07,16.51 147.07,6.35 146.05,6.35 146.05,2.54 SV5.31
CTRL81
  Top 0.254: SV6.1 106.68,91.95 105.92,91.19 105.92,83.82 Q81.2
LED1  (via drill 0.61)
  Top 0.254: Q1.3 v3.81,21.08
  Bottom 0.254: v3.81,21.08 3.81,34.04 1.52,36.32 1.52,53.34 5.33,53.34 6.6,54.61 6.6,55.88 JP1.2
LED2
  Top 0.254: Q2.3 3.81,26.67 1.27,29.21 1.27,39.12 2.79,40.64 2.79,50.8 4.32,52.32 6.6,52.32 6.6,53.85 8.38,53.85 8.38,55.88 JP1.3
LED3  (via drill 0.61)
  Top 0.254: Q3.3 v11.43,20.83
  Bottom 0.254: v11.43,20.83 4.32,27.94 4.32,34.29 3.3,35.31 3.3,47.24 11.18,47.24 12.45,48.51 12.45,55.88 JP1.4
LED4
  Top 0.254: Q4.3 11.43,26.67 7.87,30.23 7.87,34.04 3.3,38.61 3.3,45.21 6.6,45.21 6.6,49.53 JP2.2
LED5
  Top 0.254: Q5.3 19.05,19.05 13.97,24.13 13.97,33.27 12.95,34.29 10.41,34.29 10.41,40.39 11.94,41.91 11.94,45.72 8.64,49.02 8.64,49.53 JP2.3
LED6  (via drill 0.61)
  Top 0.254: v11.68,38.86 11.68,40.89 12.45,41.66 12.45,46.99 10.67,48.77 10.67,49.53 JP2.4 | Q6.3 v19.05,31.5
  Bottom 0.254: v19.05,31.5 v11.68,38.86
LED7  (via drill 0.61)
  Top 0.254: v25.4,19.05 26.67,19.05 Q7.3 | v9.14,33.53 6.86,35.81 6.86,43.18 JP3.2
  Bottom 0.254: v25.4,19.05 14.48,29.97 12.7,29.97 v9.14,33.53
LED8  (via drill 0.61)
  Top 0.254: v25.4,26.67 26.67,26.67 Q8.3
  Bottom 0.254: v25.4,26.67 21.59,30.48 13.46,30.48 9.4,34.54 4.83,34.54 4.06,35.31 4.06,39.88 6.6,39.88 8.38,41.66 8.38,43.18 JP3.3
LED9  (via drill 0.61)
  Top 0.254: Q9.3 34.29,19.3 v35.81,20.83
  Bottom 0.254: JP3.4 11.18,43.18 18.54,35.81 34.29,35.81 34.29,22.86 35.81,21.34 v35.81,20.83
LED10
  Top 0.254: Q10.3 34.29,26.67 29.21,31.75 29.21,36.58 23.37,42.42 23.37,50.8 20.07,53.85 18.29,53.85 18.29,55.88 JP4.2
LED11  (via drill 0.61)
  Top 0.254: Q11.3 v41.91,20.83
  Bottom 0.254: JP4.3 20.07,55.88 20.07,54.61 21.34,53.34 24.38,53.34 24.38,42.93 27.43,39.88 34.8,39.88 34.8,27.43 41.4,20.83 v41.91,20.83
LED12
  Top 0.254: Q12.3 41.91,26.67 27.43,41.15 25.4,41.15 25.4,42.93 23.88,44.45 23.88,54.1 22.1,55.88 JP4.4
LED13  (via drill 0.61)
  Top 0.254: v5.08,35.56 3.81,35.56 Q13.3 | v12.7,39.88 14.22,41.4 14.22,44.7 18.03,48.51 18.03,49.53 JP5.2
  Bottom 0.254: v5.08,35.56 9.4,39.88 v12.7,39.88
LED14
  Top 0.254: Q14.3 11.43,35.56 14.73,38.86 14.73,44.45 17.78,47.5 19.81,47.5 19.81,49.53 JP5.3
LED15  (via drill 0.61)
  Top 0.254: Q15.3 v19.05,37.59
  Bottom 0.254: JP5.4 23.88,49.53 23.88,41.66 19.81,37.59 v19.05,37.59
LED16
  Top 0.254: Q16.3 26.67,35.56 21.08,41.15 18.29,41.15 18.29,43.18 JP6.2
LED17  (via drill 0.61)
  Top 0.254: v14.22,45.97 14.22,56.13 8.89,61.47 8.89,76.2 3.81,81.28 Q17.3
  Bottom 0.254: v14.22,45.97 14.48,45.72 18.8,45.72 19.81,44.7 19.81,43.18 JP6.3
LED18  (via drill 0.61)
  Top 0.254: v13.21,47.5 13.21,56.13 8.38,60.96 8.38,67.82 3.81,72.39 Q18.3
  Bottom 0.254: v13.21,47.5 13.72,46.99 19.56,46.99 21.84,44.7 21.84,43.18 JP6.4
LED19  (via drill 0.61)
  Top 0.254: v27.69,60.96 29.46,58.42 29.46,55.88 JP7.2 | v11.43,79.5 Q19.3
  Bottom 0.254: v11.43,79.5 26.42,65.02 26.42,62.48 26.67,62.48 v27.69,60.96
LED20  (via drill 0.61)
  Top 0.254: v12.7,72.39 11.43,72.39 Q20.3 | v26.16,61.47 26.16,54.61 27.18,53.59 31.24,53.59 31.24,55.88 JP7.3
  Bottom 0.254: v12.7,72.39 23.62,61.47 v26.16,61.47
LED21
  Top 0.254: Q21.3 19.05,81.28 22.35,77.98 22.35,73.91 33.27,62.99 33.27,55.88 JP7.4
LED22
  Top 0.254: Q22.3 19.05,72.39 24.13,67.31 24.13,59.18 25.65,57.66 25.65,53.85 29.46,50.04 29.46,49.53 JP8.2
LED23
  Top 0.254: Q23.3 26.67,81.28 28.7,79.25 28.7,76.45 32.77,72.39 32.77,64.26 34.8,62.23 34.8,53.59 31.5,50.29 31.5,49.53 JP8.3
LED24  (via drill 0.61)
  Top 0.254: v27.94,72.39 26.67,72.39 Q24.3 | v34.8,66.04 35.31,65.53 35.31,53.34 33.53,51.56 33.53,49.53 JP8.4
  Bottom 0.254: v27.94,72.39 34.29,66.04 v34.8,66.04
LED25  (via drill 0.61)
  Top 0.254: v34.29,78.74 Q25.3
  Bottom 0.254: v34.29,78.74 46.74,66.29 46.74,46.74 31.75,46.74 29.72,44.7 29.72,43.18 JP9.2
LED26
  Top 0.254: Q26.3 34.29,72.39 35.81,70.87 35.81,53.09 34.8,52.07 34.8,46.99 31.5,43.69 31.5,43.18 JP9.3
LED27  (via drill 0.61)
  Top 0.254: v41.91,79.25 Q27.3
  Bottom 0.254: JP9.4 34.54,43.18 37.08,45.72 46.48,45.72 48.26,47.5 48.26,73.66 42.67,79.25 v41.91,79.25
LED28
  Top 0.254: Q28.3 41.91,72.39 41.15,71.63 41.15,55.88 JP10.2
LED29  (via drill 0.61)
  Top 0.254: v5.08,63.5 3.81,63.5 Q29.3
  Bottom 0.254: v5.08,63.5 8.13,60.45 25.15,60.45 26.67,58.93 41.15,58.93 42.67,57.4 42.67,55.88 JP10.3
LED30  (via drill 0.61)
  Top 0.254: v12.7,63.5 11.43,63.5 Q30.3
  Bottom 0.254: v12.7,63.5 15.24,60.96 25.4,60.96 26.67,59.69 28.7,59.69 28.7,61.98 28.45,62.23 27.69,62.23 26.92,63.25 26.92,64.52 37.59,64.52 44.7,57.4 44.7,55.88 JP10.4
LED31  (via drill 0.61)
  Top 0.254: v24.64,55.37 24.64,57.91 19.05,63.5 Q31.3
  Bottom 0.254: v24.64,55.37 27.94,52.07 39.62,52.07 40.89,50.8 40.89,49.53 JP11.2
LED32  (via drill 0.61)
  Top 0.254: v27.94,63.5 26.67,63.5 Q32.3 | v36.83,60.45 37.08,60.2 37.08,54.61 38.86,52.83 40.39,52.83 40.89,52.32 40.89,51.56 42.67,51.56 42.67,49.53 JP11.3
  Bottom 0.254: v27.94,63.5 30.99,60.45 v36.83,60.45
LED33
  Top 0.254: Q33.3 54.61,19.05 46.23,27.43 46.23,48.26 44.96,49.53 JP11.4
LED34  (via drill 0.61)
  Top 0.254: v52.32,26.42 54.61,26.42 Q34.3
  Bottom 0.254: v52.32,26.42 40.89,37.85 40.89,43.18 JP12.2
LED35  (via drill 0.61)
  Top 0.254: v60.96,19.05 62.23,19.05 Q35.3
  Bottom 0.254: v60.96,19.05 47.75,32.26 47.24,32.26 42.93,36.58 42.93,43.18 JP12.3
LED36  (via drill 0.61)
  Top 0.254: Q36.3 62.23,26.42 59.44,26.42 59.44,25.65 v58.42,24.64
  Bottom 0.254: JP12.4 44.96,43.18 44.96,41.66 44.2,40.89 43.69,40.89 43.69,36.58 47.5,32.77 48.01,32.77 53.85,26.92 56.64,26.92 56.64,26.42 v58.42,24.64
LED37  (via drill 0.61)
  Top 0.254: v68.58,19.05 69.85,19.05 Q37.3 | v47.75,33.78 48.51,34.54 48.51,51.56 52.32,55.37 52.32,55.88 JP13.2
  Bottom 0.254: v68.58,19.05 60.2,27.43 54.1,27.43 v47.75,33.78
LED38  (via drill 0.61)
  Top 0.254: v51.05,39.88 49.02,41.91 49.02,50.8 52.07,53.85 54.1,53.85 54.1,55.88 JP13.3 | v69.85,31.5 Q38.3
  Bottom 0.254: v69.85,31.5 62.74,38.61 58.42,38.61 57.15,39.88 v51.05,39.88
LED39  (via drill 0.61)
  Top 0.254: v76.2,19.05 77.47,19.05 Q39.3 | v64.77,26.92 58.42,33.27 58.42,53.85 56.39,55.88 JP13.4
  Bottom 0.254: v76.2,19.05 68.33,26.92 v64.77,26.92
LED40  (via drill 0.61)
  Top 0.254: v74.17,29.97 77.47,26.67 Q40.3 | v57.4,38.35 57.66,38.61 57.66,45.21 55.37,47.5 52.58,47.5 52.58,49.53 JP14.2
  Bottom 0.254: v74.17,29.97 73.66,30.48 65.28,30.48 v57.4,38.35
LED41  (via drill 0.61)
  Top 0.254: v83.82,19.05 85.09,19.05 Q41.3
  Bottom 0.254: v83.82,19.05 74.93,27.94 54.86,27.94 44.2,38.61 44.2,39.88 45.47,39.88 48.51,42.93 48.51,46.99 53.09,46.99 54.1,48.01 54.1,49.53 JP14.3
LED42  (via drill 0.61)
  Top 0.254: v85.09,28.96 Q42.3
  Bottom 0.254: v85.09,28.96 84.58,29.46 75.95,29.46 66.29,39.12 59.18,39.12 58.17,40.13 58.17,49.53 JP14.4
LED43  (via drill 0.61)
  Top 0.254: v91.44,19.05 92.71,19.05 Q43.3 | v52.07,36.83 52.07,42.93 52.32,43.18 JP15.2
  Bottom 0.254: v91.44,19.05 82.04,28.45 61.72,28.45 53.34,36.83 v52.07,36.83
LED44  (via drill 0.61)
  Top 0.254: v87.88,26.42 92.71,26.42 Q44.3 | v54.1,38.1 54.1,43.18 JP15.3
  Bottom 0.254: v87.88,26.42 86.36,27.94 83.31,27.94 82.3,28.96 61.98,28.96 54.1,36.83 v54.1,38.1
LED45
  Top 0.254: Q45.3 54.61,35.56 56.13,37.08 56.13,43.18 JP15.4
LED46
  Top 0.254: Q46.3 62.23,35.56 60.45,37.34 60.45,46.23 59.94,46.74 59.94,50.55 60.96,51.56 62.74,51.56 63.75,52.58 63.75,54.36 63.75,55.37 63.75,55.88 JP16.2
LED47
  Top 0.254: Q47.3 69.85,35.56 69.09,36.32 69.09,51.56 65.79,54.86 65.79,55.88 JP16.3
LED48  (via drill 0.61)
  Top 0.254: Q48.3 v77.47,37.08 | v70.87,55.12 70.87,42.42 73.66,39.62 v74.42,39.62
  Bottom 0.254: 74.68,39.62 v74.42,39.62 75.18,39.62 77.47,37.34 v77.47,37.08 | v70.87,55.12 70.1,55.88 JP16.4
LED49  (via drill 0.61)
  Top 0.254: Q49.3 54.61,81.28 59.69,76.2 59.69,55.12 61.21,53.59 61.72,53.59 v62.23,53.09 | 63.75,49.53 JP17.2 63.75,49.55 63.75,51.31 64.52,51.31 65.28,52.07 65.79,52.07 v66.55,52.83
  Bottom 0.254: v62.23,53.09 62.48,52.83 v66.55,52.83
LED50  (via drill 0.61)
  Top 0.254: v60.71,52.83 60.71,53.09 59.18,54.61 59.18,67.82 54.61,72.39 Q50.3
  Bottom 0.254: v60.71,52.83 61.47,52.07 64.52,52.07 65.53,51.05 65.53,49.53 JP17.3
LED51  (via drill 0.61)
  Top 0.254: v68.83,53.09 69.09,53.34 69.09,57.4 66.8,59.69 66.8,76.71 62.23,81.28 Q51.3
  Bottom 0.254: v68.83,53.09 68.83,49.53 JP17.4
LED52  (via drill 0.61)
  Top 0.254: v62.23,70.87 Q52.3
  Bottom 0.254: v62.23,70.87 62.23,64.26 59.18,61.21 59.18,45.72 62.48,45.72 63.75,44.45 63.75,43.18 JP18.2
LED53  (via drill 0.61)
  Top 0.254: v73.15,74.17 73.15,77.98 69.85,81.28 Q53.3
  Bottom 0.254: JP18.3 65.79,43.18 65.79,44.45 67.06,45.72 69.6,45.72 69.6,52.58 71.88,54.86 71.88,56.13 71.37,56.64 71.37,57.4 72.39,58.42 74.17,58.42 74.17,73.15 v73.15,74.17
LED54  (via drill 0.61)
  Top 0.254: v60.96,46.99 67.56,46.99 67.56,43.18 JP18.4 | v69.85,70.87 Q54.3
  Bottom 0.254: v69.85,70.87 63.5,64.52 63.25,64.52 59.69,60.96 59.69,46.99 v60.96,46.99
LED55  (via drill 0.61)
  Top 0.254: v77.47,78.49 Q55.3
  Bottom 0.254: v77.47,78.49 77.47,58.42 76.45,58.42 75.44,57.4 75.44,55.88 JP19.2
LED56
  Top 0.254: 76.96,56.64 76.96,55.88 JP19.3 76.96,56.12 76.96,60.2 75.44,60.2 74.93,60.71 74.93,69.85 77.47,72.39 Q56.3
LED57  (via drill 0.61)
  Top 0.254: v87.38,76.2 87.38,78.99 85.09,81.28 Q57.3 | v83.06,61.47 79.25,57.66 79.25,55.88 JP19.4
  Bottom 0.254: v87.38,76.2 87.38,75.44 83.06,71.12 v83.06,61.47
LED58
  Top 0.254: Q58.3 85.09,72.39 84.07,71.37 84.07,61.21 82.04,59.18 81.79,59.18 80.77,58.17 80.77,54.86 77.47,51.56 75.44,51.56 75.44,49.53 JP20.2
LED59  (via drill 0.61)
  Top 0.254: v84.84,60.71 82.55,58.42 82.04,58.42 82.04,54.86 77.22,50.04 77.22,49.53 JP20.3 | v92.71,79.5 Q59.3
  Bottom 0.254: v92.71,79.5 84.84,71.63 v84.84,60.71
LED60
  Top 0.254: Q60.3 92.71,72.39 86.87,66.55 86.87,60.2 84.58,57.91 82.55,57.91 82.55,52.83 79.25,49.53 JP20.4
LED61  (via drill 0.61)
  Top 0.254: v59.44,40.13 59.44,53.59 58.67,54.36 58.67,59.44 54.61,63.5 Q61.3
  Bottom 0.254: v59.44,40.13 59.69,39.88 73.15,39.88 75.18,41.91 75.18,43.18 JP21.2
LED62  (via drill 0.61)
  Top 0.254: v63.5,63.5 62.23,63.5 Q62.3 | v70.87,60.45 71.88,59.44 71.88,48.26 74.93,45.21 76.96,45.21 76.96,43.18 JP21.3
  Bottom 0.254: v63.5,63.5 66.55,60.45 v70.87,60.45
LED63
  Top 0.254: Q63.3 69.85,51.31 70.36,50.8 70.36,39.62 71.88,38.1 78.99,38.1 78.99,43.18 JP21.4
LED64  (via drill 0.61)
  Top 0.254: v78.74,63.5 77.47,63.5 Q64.3
  Bottom 0.254: v78.74,63.5 81.79,60.45 83.57,60.45 86.61,57.4 86.61,55.88 JP22.2
LED65
  Top 0.254: Q65.3 105.41,19.05 94.74,29.72 94.74,40.89 92.46,43.18 92.46,51.56 88.65,55.37 88.65,55.88 JP22.3
LED66
  Top 0.254: Q66.3 105.41,26.67 95.25,36.83 95.25,41.15 92.96,43.43 92.96,53.59 90.68,55.88 JP22.4
LED67  (via drill 0.61)
  Top 0.254: v111.76,19.05 113.03,19.05 Q67.3 | JP23.2 86.61,49.53 86.61,49.02 83.31,45.72 83.31,41.4 84.84,39.88 v85.6,39.88
  Bottom 0.254: v111.76,19.05 93.98,36.83 88.65,36.83 v85.6,39.88
LED68  (via drill 0.61)
  Top 0.254: v109.22,30.48 113.03,26.67 Q68.3 | v93.73,39.88 91.95,41.66 91.95,45.72 88.65,49.02 88.65,49.53 JP23.3
  Bottom 0.254: v109.22,30.48 107.7,32 101.6,32 v93.73,39.88
LED69  (via drill 0.61)
  Top 0.254: v107.19,35.05 115.57,26.67 115.57,24.13 120.65,19.05 Q69.3
  Bottom 0.254: v107.19,35.05 102.87,39.37 96.52,39.37 92.46,43.43 92.46,49.53 JP23.4
LED70  (via drill 0.61)
  Top 0.254: v119.38,26.67 120.65,26.67 Q70.3
  Bottom 0.254: v119.38,26.67 116.59,29.46 102.87,29.46 92.46,39.88 88.65,39.88 86.87,41.66 86.87,43.18 JP24.2
LED71  (via drill 0.61)
  Top 0.254: v127,19.05 128.27,19.05 Q71.3 | v87.38,39.88 88.39,40.89 88.39,43.18 JP24.3
  Bottom 0.254: v127,19.05 120.4,25.65 105.92,25.65 94.23,37.34 89.92,37.34 v87.38,39.88
LED72  (via drill 0.61)
  Top 0.254: v127,26.67 128.27,26.67 Q72.3
  Bottom 0.254: v127,26.67 119.63,34.04 100.84,34.04 91.69,43.18 JP24.4
LED73  (via drill 0.61)
  Top 0.254: v115.06,53.34 131.57,36.83 131.57,23.37 135.89,19.05 Q73.3
  Bottom 0.254: v115.06,53.34 107.95,60.45 101.35,60.45 98.3,57.4 98.3,55.88 JP25.2
LED74  (via drill 0.61)
  Top 0.254: v111,45.47 107.44,49.02 107.44,53.34 102.87,57.91 100.08,57.91 100.08,55.88 JP25.3 | v135.89,28.96 Q74.3
  Bottom 0.254: v135.89,28.96 119.38,45.47 v111,45.47
LED75  (via drill 0.61)
  Top 0.254: v142.24,19.05 143.51,19.05 Q75.3 | v111,38.86 106.93,42.93 106.93,51.05 102.11,55.88 JP25.4
  Bottom 0.254: v142.24,19.05 126.75,34.54 115.32,34.54 v111,38.86
LED76  (via drill 0.61)
  Top 0.254: v142.24,26.67 143.51,26.67 Q76.3
  Bottom 0.254: v142.24,26.67 122.43,46.48 99.82,46.48 98.3,48.01 98.3,49.53 JP26.2
LED77
  Top 0.254: Q77.3 105.41,35.56 103.38,37.59 103.38,45.72 100.08,49.02 100.08,49.53 JP26.3
LED78  (via drill 0.61)
  Top 0.254: v104.39,50.04 106.43,48.01 106.43,42.16 113.03,35.56 Q78.3
  Bottom 0.254: v104.39,50.04 103.89,49.53 JP26.4
LED79  (via drill 0.61)
  Top 0.254: v119.38,35.56 120.65,35.56 Q79.3
  Bottom 0.254: v119.38,35.56 115.06,39.88 100.08,39.88 98.3,41.66 98.3,43.18 JP27.2
LED80  (via drill 0.61)
  Top 0.254: v127,35.56 128.27,35.56 Q80.3
  Bottom 0.254: v127,35.56 121.92,40.64 101.35,40.64 100.08,41.91 100.08,43.18 JP27.3
LED81
  Top 0.254: Q81.3 106.68,81.28 94.74,69.34 94.74,48.26 97.79,45.21 101.85,45.21 101.85,43.18 JP27.4

### Text on the board
Top: LargeED_Cube_v1